# Altium schematic sheet CAN_module.SchDoc
size A; SheetNumber: 2; SheetTotal: 2
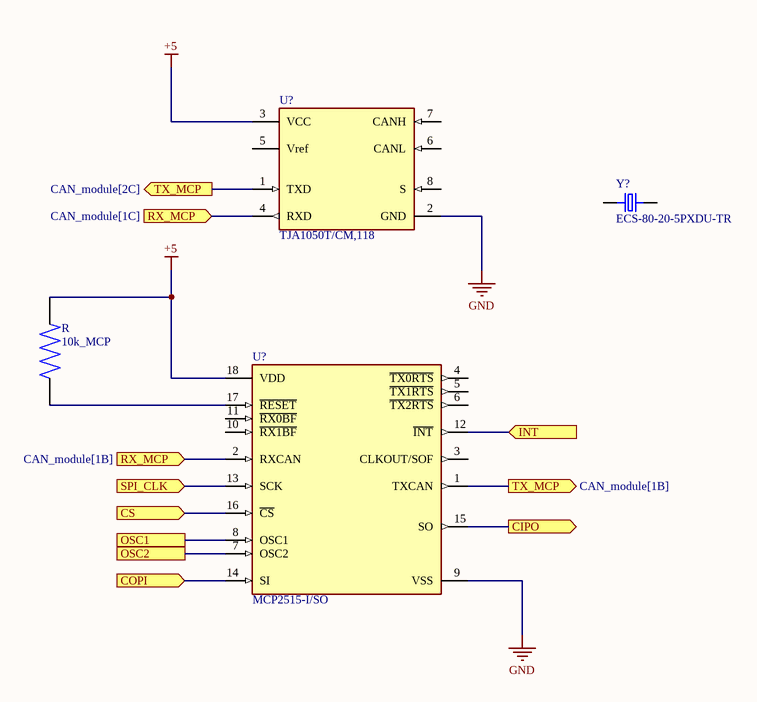
[diagram p0: CAN_module.SchDoc]

## Parts
(Parts that share a designator on the sheet are numbered #1, #2 ... from top to bottom, then left to right.)
R  10k_MCP  [RESC2012X60N]
U?#1  TJA1050T/CM,118  [FP-SOT96-1-IPC_A]
U?#2  MCP2515-I/SO  [FP-C04-051-MFG]
Y?  ECS-80-20-5PXDU-TR  [XTAL_ECS-80-20-5PXDU-TR]

## Ports
CIPO (out), COPI (in), CS (in), INT (in), OSC1, OSC2, RX_MCP (in, see CAN_module[1B]), RX_MCP (in, see CAN_module[1C]), SPI_CLK (in), TX_MCP (out, see CAN_module[1B]), TX_MCP (out, see CAN_module[2C])

## Nets
+5: R.2 U?#1.3(VCC) U?#2.18(VDD)
GND: U?#1.2(GND) U?#2.9(VSS)
CIPO: U?#2.15(SO) ; port CIPO
COPI: U?#2.14(SI) ; port COPI
CS: U?#2.16(~{CS}) ; port CS
INT: U?#2.12(~{INT}) ; port INT
OSC1: U?#2.8(OSC1) ; port OSC1
OSC2: U?#2.7(OSC2) ; port OSC2
RX_MCP: U?#1.4(RXD) U?#2.2(RXCAN) ; port RX_MCP
SPI_CLK: U?#2.13(SCK) ; port SPI_CLK
TX_MCP: U?#1.1(TXD) U?#2.1(TXCAN) ; port TX_MCP
NetR_1: R.1 U?#2.17(~{RESET})

Not connected (* = marked no-connect by the designer): U?#1 5(Vref) 6(CANL) 7(CANH) 8(S); U?#2 3(CLKOUT/SOF) 4(~{TX0RTS}) 5(~{TX1RTS}) 6(~{TX2RTS}) 10(~{RX1BF}) 11(~{RX0BF}); Y? 1 2

## Library data of the parts
R = RC0805JR-071ML: 1 MOhms Â±5% 0.125W, 1/8W Chip Resistor 0805 _2012 Metric_ Moisture Resistant Thick Film; MF: Yageo; SnapEDA_Link: https://www.snapeda.com/parts/RC0805JR-071ML/Yageo/view-part/106012/?ref=snap; Availability: Unavailable; Price: None; Package: 2012 Rohm Semiconductor; MP: RC0805JR-071ML; Value: *
U?#1 = CMP-2000-04923-2: IC TRANSCEIVER HALF 1/1 8SO; Simplex/Duplex: Half Duplex; Max Supply Current: 10mA; Number of Receive Buffers: 1; Min Supply Voltage: 4.75V; Max Supply Voltage: 5.25V; Interface: CAN; Data Rate: 1Mbps; Receiver Hysteresis: 70mV; Number of Transmit Buffers: 1; Min Operating Temperature: -40°C; Case/Package: SO; REACH SVHC: No SVHC; Max Operating Temperature: 150°C; Number of Pins: 8; Lead Free: Lead Free; Number of Transceivers: 1; Packaging: Tape and Reel; Mount: Surface Mount; Radiation Hardening: No; Nominal Supply Current: 10mA; Package Quantity: 2500; Contact Plating: Gold
U?#2 = CMP-0186-00133-3: IC CAN CONTROLLER W/SPI 18SOIC; Manufacturer: Microchip; Min Supply Voltage: 2.7V; Max Supply Voltage: 5.5V; Standoff Height: 0.1mm; Nominal Supply Current: 10mA; Interface: SPI,CAN; Lead Free: Yes; Digikey Description: IC CAN CONTROLLER W/SPI 18SOIC; Category: IC; RoHS: TRUE; Manufacturer Part Number: MCP2515-I/SO; ComponentLink2URL: http://ww1.microchip.com/downloads/en/DeviceDoc/MCP2515-Stand-Alone-CAN-Controller-with-SPI-20001801J.pdf; Mouser Description: CAN Interface IC W/ SPI Interface; Device Class L2: Interface ICs; Package: C04-051; Automotive: No; Function: Controller; Octopart: https://octopart.com/mcp2515-i%2Fso-microchip-430187; Temperature: -40°C to +85°C; Ipc Land Pattern Name: SOIC127P1030X265-18; Ambient Temperature Range Low: -65°C; Height: 2.65mm; Device Class L1: Integrated Circuits (ICs); Ambient Temperature Range High: +125°C; Footprint Url: http://ww1.microchip.com/downloads/en/DeviceDoc/18L_SOIC_Wide_7.50_SO_C04-0051D.pdf; Temperature Range Low: -40°C; Device Class L3: Controllers; Temperature Range High: +85°C; ComponentLink2Description: Datasheet
Y? = ECS-80-20-5PXDU-TR: 8MHz Â±30ppm Crystal 20pF 60 Ohms HC-49/US; MF: ECS Inc.; Package: HC49/US ECS International; Availability: Unavailable; Value: *; MP: ECS-80-20-5PXDU-TR; SnapEDA_Link: https://www.snapeda.com/parts/ECS-80-20-5PXDU-TR/ECS%20Inc./view-part/584052/?ref=snap; Price: None